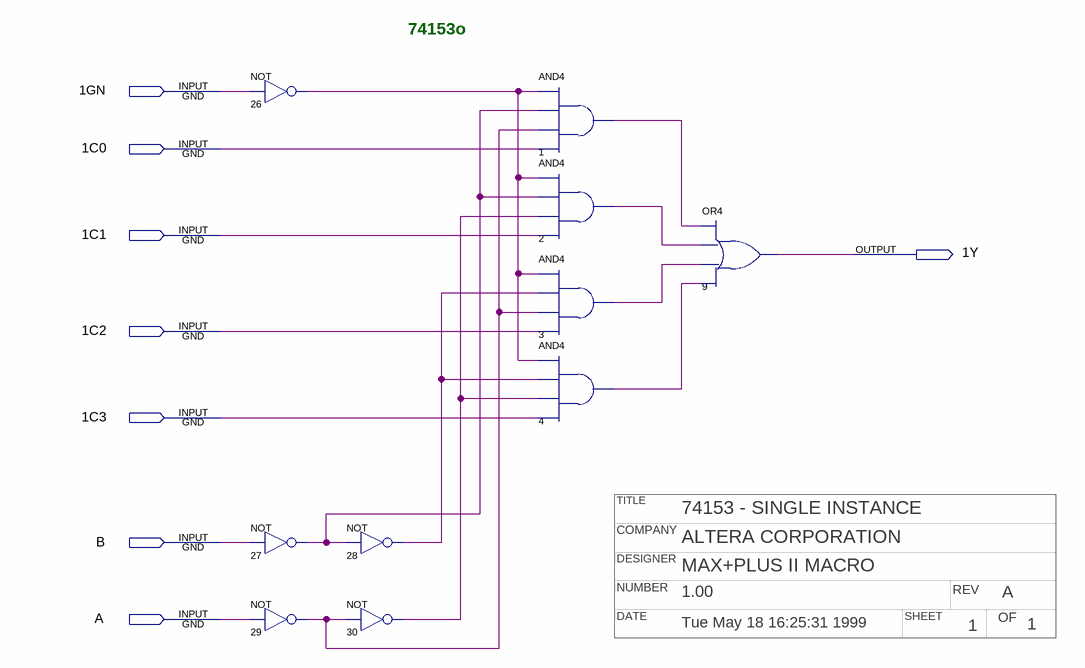
[diagram p0: schematic sheet]
// Quartus schematic 74153o.bdf as structural Verilog: 10 symbols, 8 pins
// Title block: TITLE: 74153 - SINGLE INSTANCE; COMPANY: ALTERA CORPORATION; DESIGNER: MAX+PLUS II MACRO; NUMBER: 1.00; REV: A; DATE: Tue May 18 16:25:31 1999; SHEET: 1; OF: 1
module \74153o  (
  input  \1GN ,
  input  \1C0 ,
  input  \1C1 ,
  input  \1C2 ,
  input  \1C3 ,
  input  B,
  input  A,
  output \1Y 
);

  wire n1_out, n2_out, n3_out, n4_out, n26_out, n27_out, n28_out, n29_out, n30_out;

  not u_26 (n26_out, \1GN );
  not u_27 (n27_out, B);
  not u_29 (n29_out, A);
  not u_28 (n28_out, n27_out);
  not u_30 (n30_out, n29_out);
  and u_1 (n1_out, n26_out, n27_out, n29_out, \1C0 );
  and u_2 (n2_out, n26_out, n27_out, n30_out, \1C1 );
  and u_3 (n3_out, n26_out, n28_out, n29_out, \1C2 );
  and u_4 (n4_out, n26_out, n28_out, n30_out, \1C3 );
  or u_9 (\1Y , n1_out, n2_out, n3_out, n4_out);

  // Notes on the sheet:
  //   74153o
endmodule
